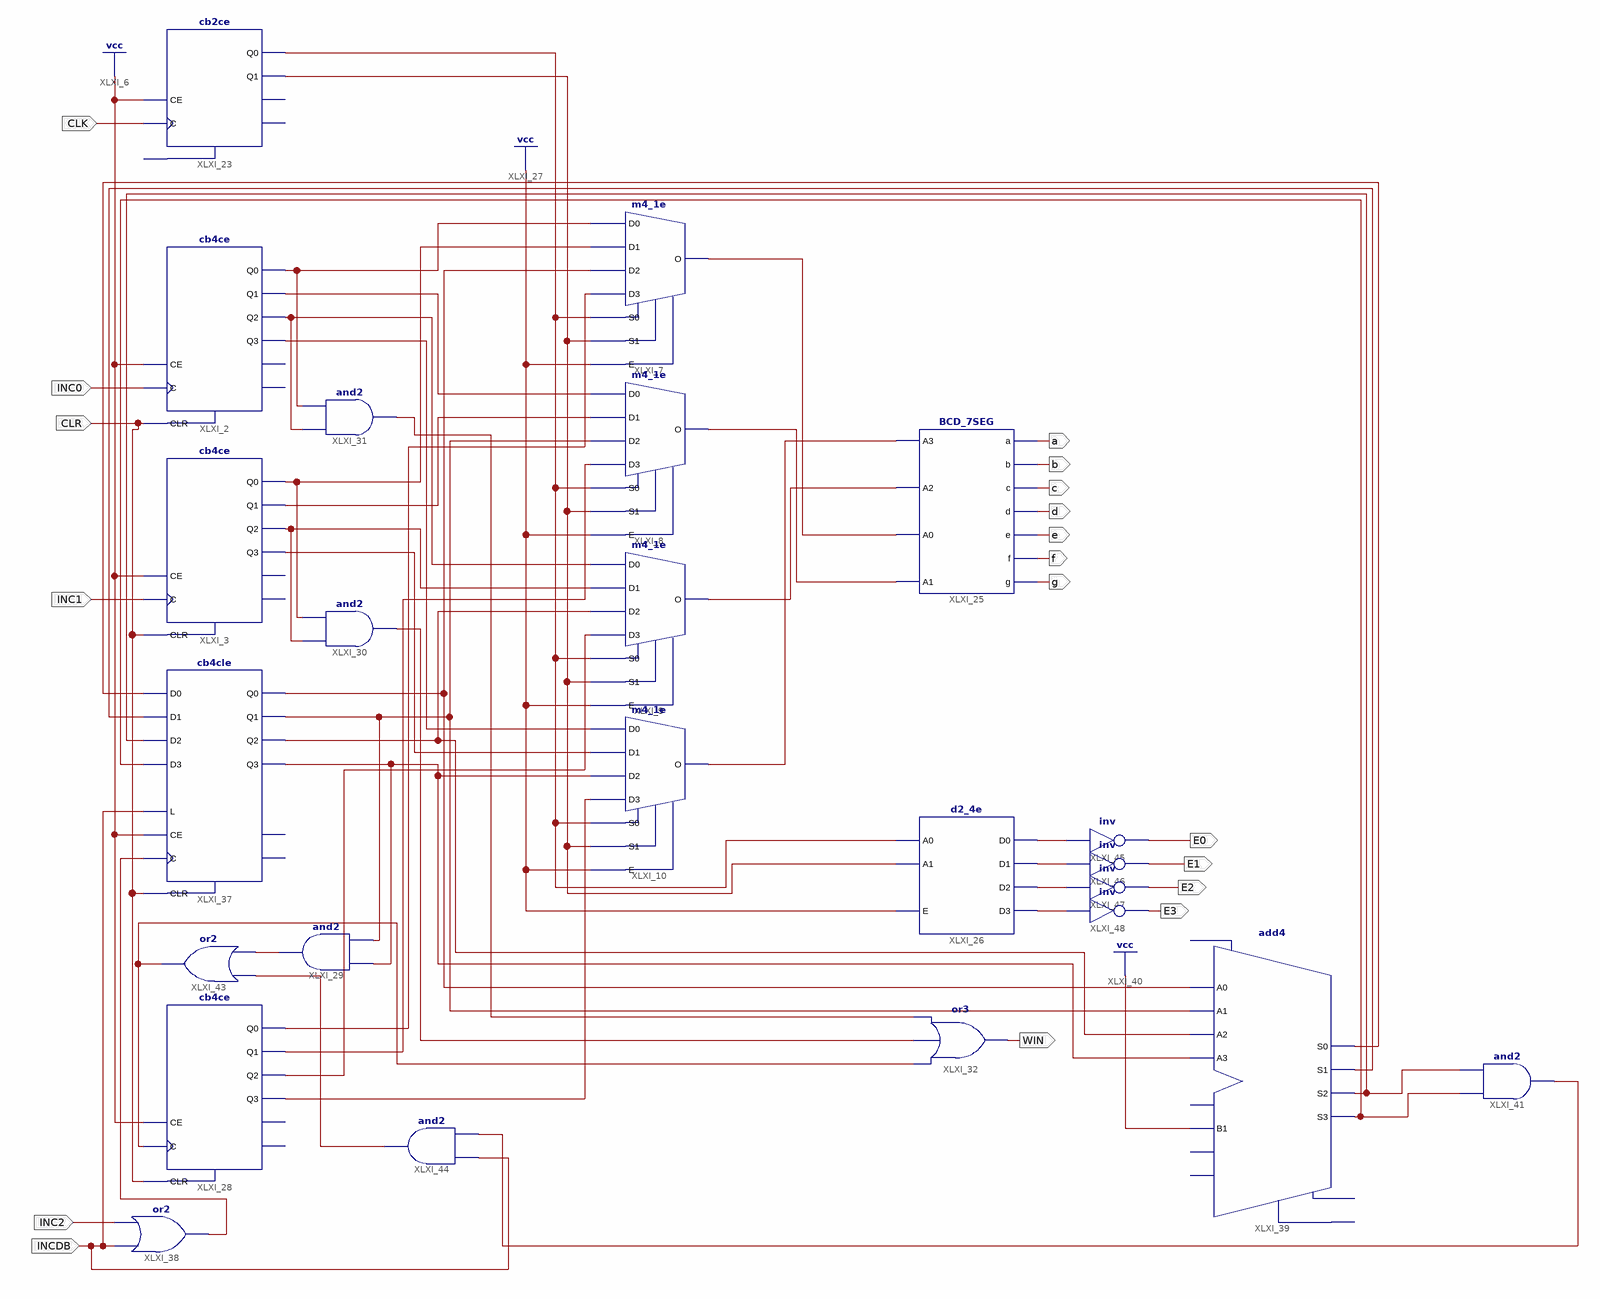
[diagram p0: schematic sheet 1]
// Xilinx ISE schematic score.sch (spartan3) as structural Verilog: 24 symbols, 18 ports
module score (
  input  INC0,
  input  INC1,
  input  CLR,
  input  CLK,
  input  INC2,
  input  INCDB,
  output a,
  output b,
  output c,
  output d,
  output e,
  output f,
  output g,
  output WIN,
  output E0,
  output E1,
  output E2,
  output E3
);

  wire XLXN_16, XLXN_17, XLXN_26, XLXN_28, XLXN_29, XLXN_30, XLXN_32, XLXN_34, XLXN_35, XLXN_36, XLXN_54,
       XLXN_55, XLXN_56, XLXN_57, XLXN_70, XLXN_71, XLXN_72, XLXN_73, XLXN_74, XLXN_75, XLXN_76, XLXN_77,
       XLXN_78, XLXN_79, XLXN_108, XLXN_115, XLXN_116, XLXN_117, XLXN_118, XLXN_119, XLXN_121, XLXN_122,
       XLXN_123, XLXN_135, XLXN_136, XLXN_137, XLXN_138;

  cb4ce XLXI_2 (
    .C(INC0), .CE(1'b1), .CLR(CLR), .Q0(XLXN_77), .Q1(XLXN_26), .Q2(XLXN_76), .Q3(XLXN_28));  // open: CEO, TC
  cb4ce XLXI_3 (
    .C(INC1), .CE(1'b1), .CLR(CLR), .Q0(XLXN_29), .Q1(XLXN_30), .Q2(XLXN_75), .Q3(XLXN_32));  // open: CEO, TC
  m4_1e XLXI_7 (
    .D0(XLXN_77), .D1(XLXN_29), .D2(XLXN_115), .D3(XLXN_71), .E(1'b1), .S0(XLXN_17), .S1(XLXN_16), .O(XLXN_54));
  m4_1e XLXI_8 (
    .D0(XLXN_26), .D1(XLXN_30), .D2(XLXN_34), .D3(XLXN_72), .E(1'b1), .S0(XLXN_17), .S1(XLXN_16), .O(XLXN_55));
  m4_1e XLXI_9 (
    .D0(XLXN_76), .D1(XLXN_75), .D2(XLXN_35), .D3(XLXN_73), .E(1'b1), .S0(XLXN_17), .S1(XLXN_16), .O(XLXN_56));
  m4_1e XLXI_10 (
    .D0(XLXN_28), .D1(XLXN_32), .D2(XLXN_36), .D3(XLXN_74), .E(1'b1), .S0(XLXN_17), .S1(XLXN_16), .O(XLXN_57));
  cb2ce XLXI_23 (.C(CLK), .CE(1'b1), .Q0(XLXN_17), .Q1(XLXN_16));  // open: CLR, CEO, TC
  BCD_7SEG XLXI_25 (
    .A3(XLXN_57), .A2(XLXN_56), .A0(XLXN_54), .A1(XLXN_55), .a(a), .b(b), .c(c), .d(d), .e(e), .f(f), .g(g));
  d2_4e XLXI_26 (.A0(XLXN_17), .A1(XLXN_16), .E(1'b1), .D0(XLXN_135), .D1(XLXN_136), .D2(XLXN_137), .D3(XLXN_138));
  cb4ce XLXI_28 (
    .C(XLXN_70), .CE(1'b1), .CLR(CLR), .Q0(XLXN_71), .Q1(XLXN_72), .Q2(XLXN_73), .Q3(XLXN_74));  // open: CEO, TC
  and XLXI_30 (XLXN_79, XLXN_75, XLXN_29);
  and XLXI_31 (XLXN_78, XLXN_76, XLXN_77);
  or XLXI_32 (WIN, XLXN_70, XLXN_79, XLXN_78);
  and XLXI_29 (XLXN_121, XLXN_36, XLXN_34);
  cb4cle XLXI_37 (
    .C(XLXN_108), .CE(1'b1), .CLR(CLR), .D0(XLXN_116), .D1(XLXN_117), .D2(XLXN_118), .D3(XLXN_119),
    .L(INCDB), .Q0(XLXN_115), .Q1(XLXN_34), .Q2(XLXN_35), .Q3(XLXN_36));  // open: CEO, TC
  or XLXI_38 (XLXN_108, INCDB, INC2);
  add4 XLXI_39 (
    .A0(XLXN_115), .A1(XLXN_34), .A2(XLXN_35), .A3(XLXN_36), .B1(1'b1), .S0(XLXN_116), .S1(XLXN_117),
    .S2(XLXN_118), .S3(XLXN_119));  // open: B0, B2, B3, CI, CO, OFL
  and XLXI_41 (XLXN_122, XLXN_119, XLXN_118);
  or XLXI_43 (XLXN_70, XLXN_123, XLXN_121);
  and XLXI_44 (XLXN_123, INCDB, XLXN_122);
  not XLXI_45 (E0, XLXN_135);
  not XLXI_48 (E3, XLXN_138);
  not XLXI_46 (E1, XLXN_136);
  not XLXI_47 (E2, XLXN_137);
endmodule
